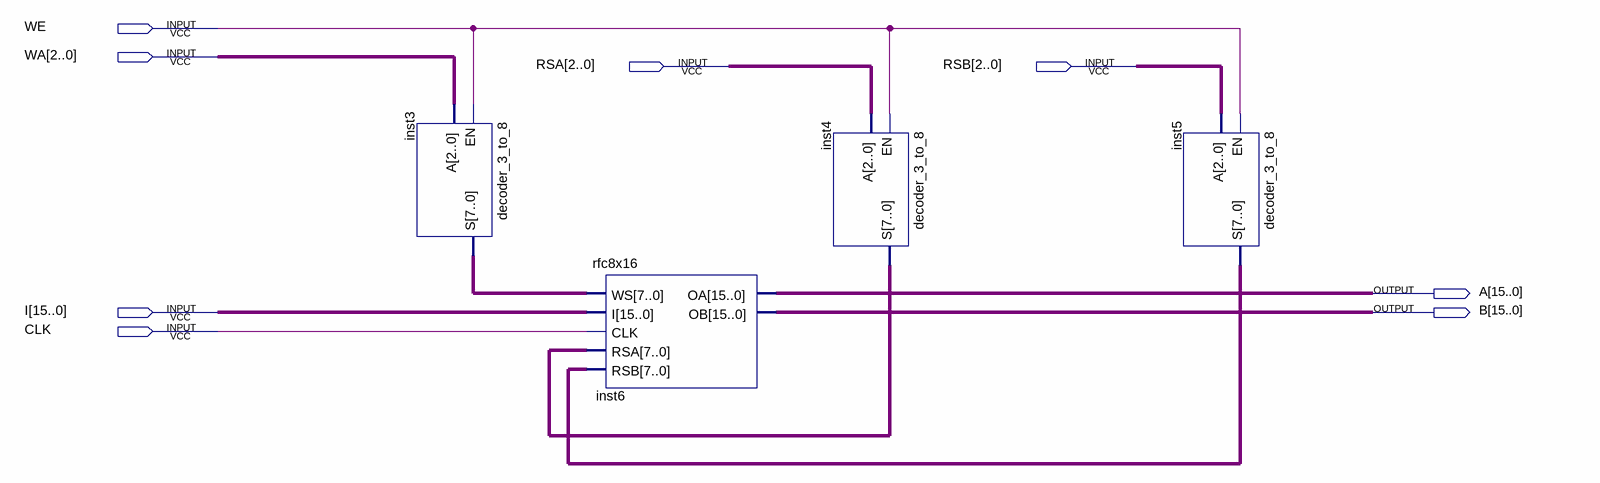
[diagram p0: schematic sheet]
// Quartus schematic register_file.bdf as structural Verilog: 4 symbols, 8 pins
module register_file (
  input  WE,
  input  [2:0] WA,
  input  [2:0] RSA,
  input  [2:0] RSB,
  input  [15:0] I,
  input  CLK,
  output [15:0] A,
  output [15:0] B
);

  wire [7:0] inst3_s, inst4_s, inst5_s;

  decoder_3_to_8 inst3 (.EN(WE), .A(WA), .S(inst3_s));
  rfc8x16 inst6 (.WS(inst3_s), .I(I), .CLK(CLK), .RSA(inst4_s), .RSB(inst5_s), .OA(A), .OB(B));
  decoder_3_to_8 inst4 (.EN(WE), .A(RSA), .S(inst4_s));
  decoder_3_to_8 inst5 (.EN(WE), .A(RSB), .S(inst5_s));
endmodule
